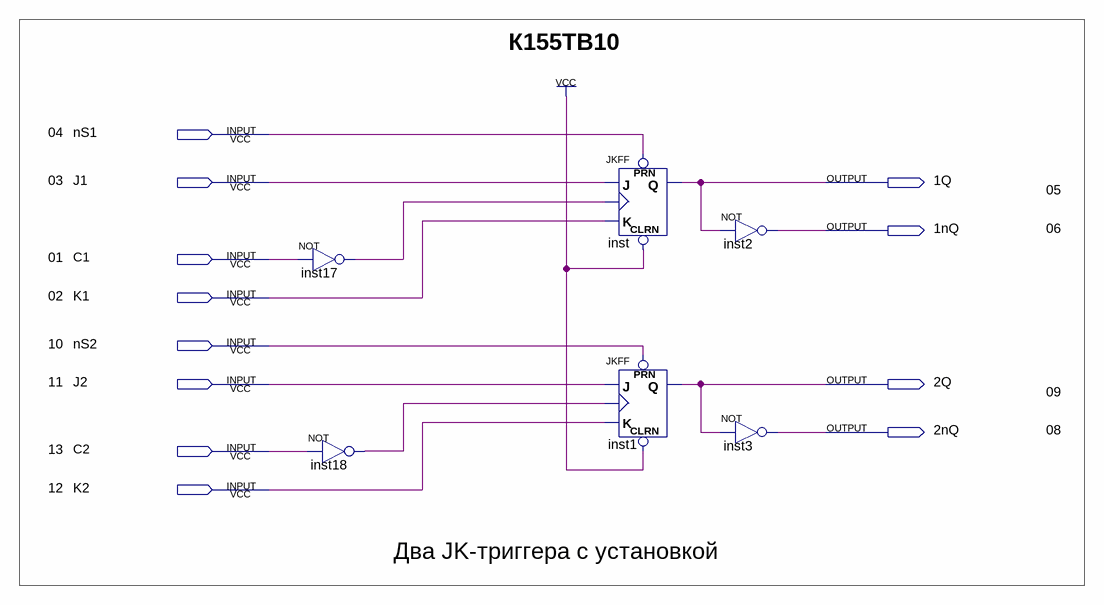
[diagram p0: schematic sheet]
// Quartus schematic K155TB10.bdf as structural Verilog: 6 symbols, 12 pins
module K155TB10 (
  input  nS1,
  input  J1,
  input  C1,
  input  K1,
  input  nS2,
  input  J2,
  input  C2,
  input  K2,
  output \1Q ,
  output \1nQ ,
  output \2Q ,
  output \2nQ 
);

  wire inst17_out, inst18_out;

  not inst17 (inst17_out, C1);
  not inst18 (inst18_out, C2);
  JKFF inst (.PRN(nS1), .CLRN(1'b1), .K(K1), .J(J1), .CLK(inst17_out), .Q(\1Q ));
  JKFF inst1 (.PRN(nS2), .CLRN(1'b1), .K(K2), .J(J2), .CLK(inst18_out), .Q(\2Q ));
  not inst2 (\1nQ , \1Q );
  not inst3 (\2nQ , \2Q );

  // Notes on the sheet:
  //   К155ТВ10
  //   04
  //   03
  //   05
  //   06
  //   01
  //   02
  //   10
  //   11
  //   09
  //   08
  //   13
  //   12
  //   Два JK-триггера с установкой
endmodule
